# EAGLE design XICIE_DISPLAY_revA (EAGLE 6.5.0)
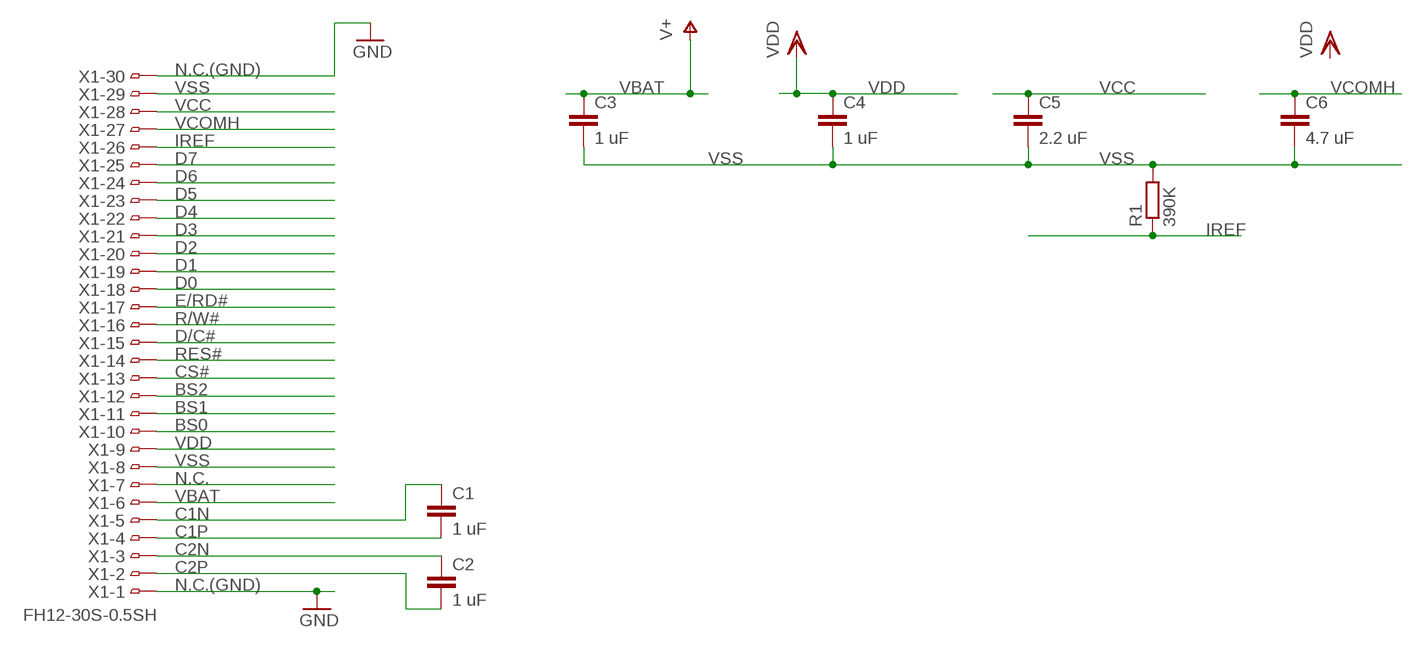
[diagram p0: schematic, sheet 1]

## Parts
C1  1 uF  C-EUC0402  [C0402]
C2  1 uF  C-EUC0402  [C0402]
C3  1 uF  C-EUC0402  [C0402]
C4  1 uF  C-EUC0402  [C0402]
C5  2.2 uF  C-EUC0603  [C0603]
C6  4.7 uF  C-EUC0603  [C0603]
R1  390K  R-EU_R0603  [R0603]
X1  FH12-30S-0.5SH  [FH12-30S-0.5SH]

## Nets
BS0: X1.10
BS1: X1.11
BS2: X1.12
C1N: C1.1 X1.5
C1P: C1.2 X1.4
C2N: C2.1 X1.3
C2P: C2.2 X1.2
CS#: X1.13
D0: X1.18
D1: X1.19
D2: X1.20
D3: X1.21
D4: X1.22
D5: X1.23
D6: X1.24
D7: X1.25
D/C#: X1.15
E/RD#: X1.17
IREF: R1.1 X1.26
N.C.: X1.7
N.C.(GND): X1.1 X1.30 ; supply symbol labelled GND
R/W#: X1.16
RES#: X1.14
VBAT: C3.1 X1.6 ; supply symbol labelled V+
VCC: C5.1 X1.28
VCOMH: C6.1 X1.27
VDD: C4.1 X1.9
VSS: C3.2 C4.2 C5.2 C6.2 R1.2 X1.8 X1.29

## Library data of the parts
C1-C6 = rcl:C-EU: CAPACITOR, European symbol
R1 = resistor:R-EU_: RESISTOR, European symbol
X1 = con-hirose:FH12-30S-0.5S: 0.5mm Pitch Connectors For FPC/FFC Source: Data sheet <http://www.hirose.co.jp/cataloge_hp/e58605370.pdf>; MPN: FH12-30S-0.5SH(55); OC_FARNELL: 1324555; OC_NEWARK: 34M6176

## Board
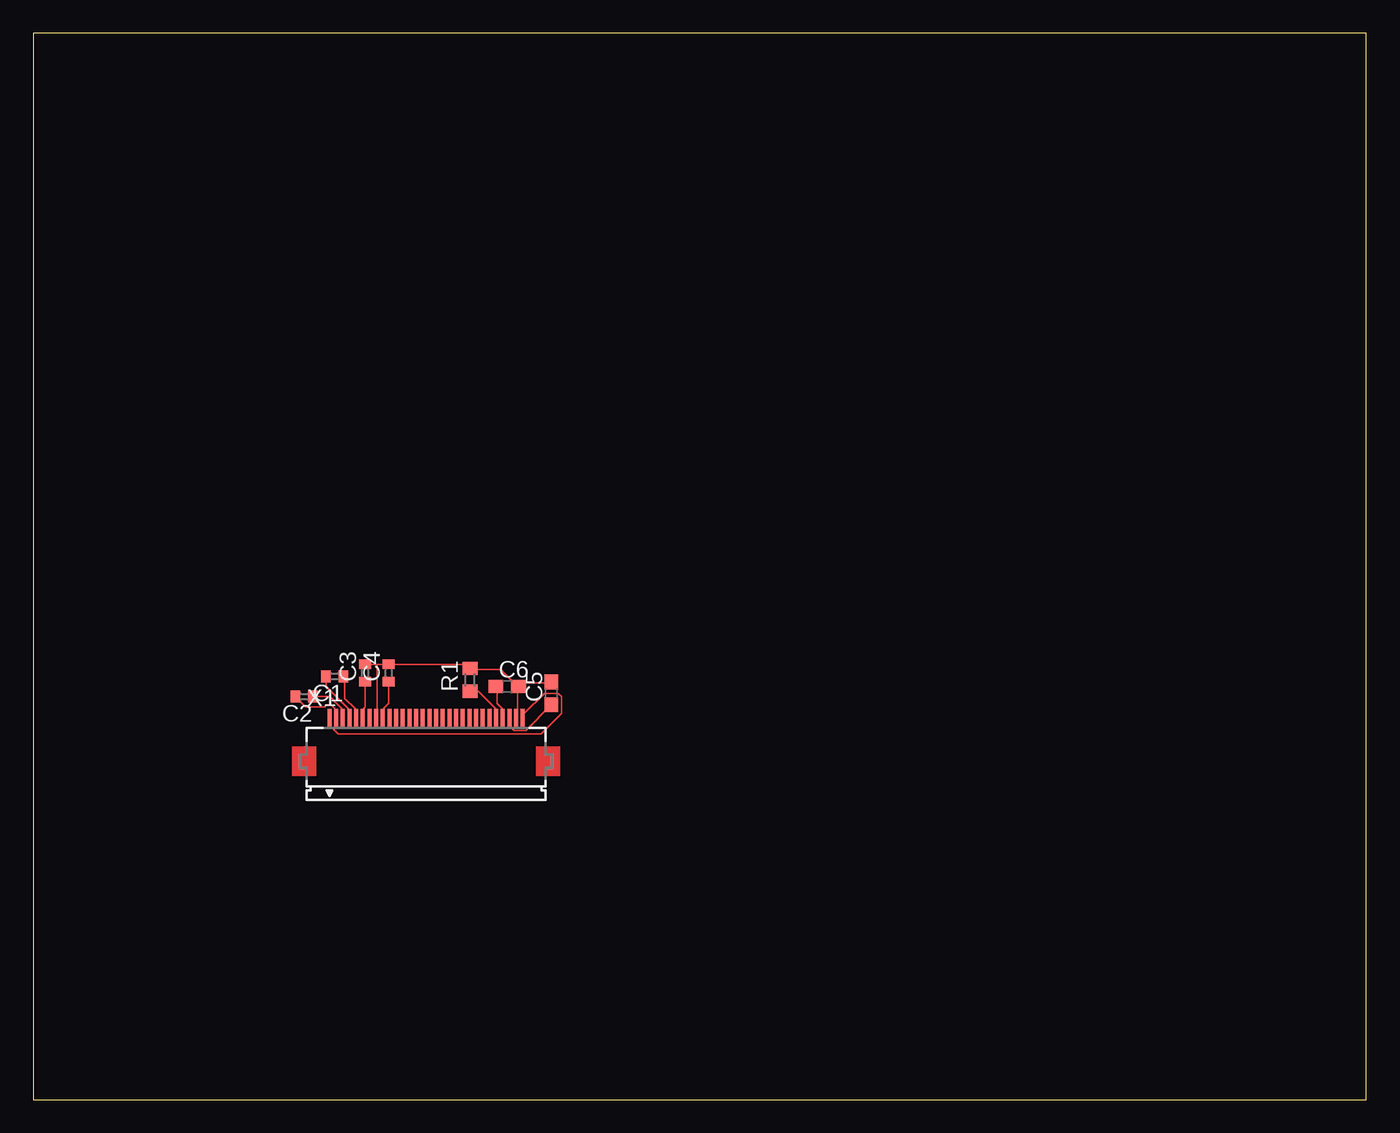
[diagram p1: board, top side]

Size 100 x 80 mm. Coordinates in mm from the lower left corner, seen from the top.
Outline: 0,0 100,0 100,80 0,80 0,0
Copper layers (1*16): Top 0.035mm / dielectric 1.5mm / Bottom 0.035mm
Design rules "default *": minimum track width 5mil, minimum drill 24mil, track to track 5mil, track to pad 5mil, pad to pad 5mil, via to via 5mil, smd to smd 5mil, copper to edge 40mil, drill to drill 8mil, minimum pad ring 10mil, minimum via ring 8mil, stop-mask expansion 4mil, vias tented up to drill 0mil, thermal gap 10mil

### Footprints (pad centres in the part's own frame; a part is rotated, then mirrored left to right if it is on the bottom)
C0402 = smd 0.7 x 0.9: 1 -0.65,0; 2 0.65,0
C0603 = smd 1.1 x 1: 1 -0.85,0; 2 0.85,0
R0603 = smd 1 x 1.1: 1 -0.85,0; 2 0.85,0
FH12-30S-0.5SH = smd 0.3 x 1.3: 1 -7.25,3.25; 2 -6.75,3.25; 3 -6.25,3.25; 4 -5.75,3.25; 5 -5.25,3.25; 6 -4.75,3.25; 7 -4.25,3.25; 8 -3.75,3.25; 9 -3.25,3.25; 10 -2.75,3.25; 11 -2.25,3.25; 12 -1.75,3.25; 13 -1.25,3.25; 14 -0.75,3.25; 15 -0.25,3.25; 16 0.25,3.25; 17 0.75,3.25; 18 1.25,3.25; 19 1.75,3.25; 20 2.25,3.25; 21 2.75,3.25; 22 3.25,3.25; 23 3.75,3.25; 24 4.25,3.25; 25 4.75,3.25; 26 5.25,3.25; 27 5.75,3.25; 28 6.25,3.25; 29 6.75,3.25; 30 7.25,3.25

### Placement (x,y rotation side)
C1  22.61,31.75 180 top
C2  20.32,30.23 180 top
C3  24.89,32 90 top
C4  26.67,32 90 top
C5  38.86,30.48 90 top
C6  35.56,30.99 0 top
R1  32.77,31.5 90 top
X1  29.46,25.4 0 top

### Tracks (layer width: path | path; a pad name or v marks a point on that pad's centre or on a via)
C1N
  Top 0.127: C1.1 23.37,31.75 23.37,30.1 24.13,29.34 24.13,28.7 X1.5
C1P
  Top 0.127: C1.2 21.97,30.99 23.62,29.34 23.62,28.7 X1.4
C2N
  Top 0.127: C2.1 22.23,30.23 23.11,29.34 23.11,28.7 X1.3
C2P
  Top 0.127: C2.2 19.68,30.23 20.45,29.46 21.84,29.46 21.97,29.59 22.35,29.59 22.61,29.34 22.61,28.7 X1.2
IREF
  Top 0.127: R1.1 32.77,30.61 33.4,30.61 34.67,29.34 34.67,28.7 X1.26
N.C.(GND)
  Top 0.127: X1.1 22.23,28.57 22.23,28.07 22.86,27.43 38.1,27.43 39.62,28.96 39.62,30.23 39.37,30.48 38.35,30.48 36.83,28.96 36.83,28.7 X1.30
VBAT
  Top 0.127: C3.1 24.89,29.46 24.77,29.34 24.77,28.7 X1.6
VCC
  Top 0.127: C5.1 38.86,29.59 36.96,27.69 36.07,27.69 35.81,27.94 35.81,28.57 X1.28
VCOMH
  Top 0.127: C6.1 34.8,30.99 34.8,29.72 35.18,29.34 35.18,28.7 X1.27
VDD
  Top 0.127: C4.1 26.67,29.72 26.29,29.34 26.29,28.7 X1.9
VSS
  Top 0.127: C4.2 25.78,32.64 | 25.78,32.64 C3.2 | 25.78,32.64 25.78,28.7 X1.8 | 36.32,30.99 36.07,31.24 | 36.07,31.24 35.05,32.26 32.77,32.26 R1.2 32.77,32.38 32.51,32.64 C4.2 | 36.07,31.24 38.86,31.24 C5.2 | 36.07,31.24 C6.2 36.32,30.99 | 36.32,30.99 36.32,28.7 X1.29 | C4.2